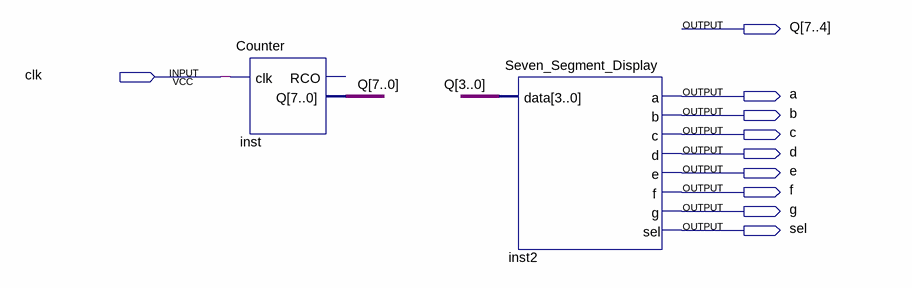
[diagram p0: schematic sheet]
// Quartus schematic bolck1.bdf as structural Verilog: 2 symbols, 10 pins
module bolck1 (
  input  clk,
  output [7:0] Q,
  output a,
  output b,
  output c,
  output d,
  output e,
  output f,
  output g,
  output sel
);

  Counter inst (.clk(clk), .Q(Q));  // open: RCO
  Seven_Segment_Display inst2 (.data(Q[3:0]), .a(a), .b(b), .c(c), .d(d), .e(e), .f(f), .g(g), .sel(sel));
endmodule
